# Altium schematic sheet ShieldBoard_Schematic.SchDoc
size A; SheetNumber: 1; SheetTotal: 1
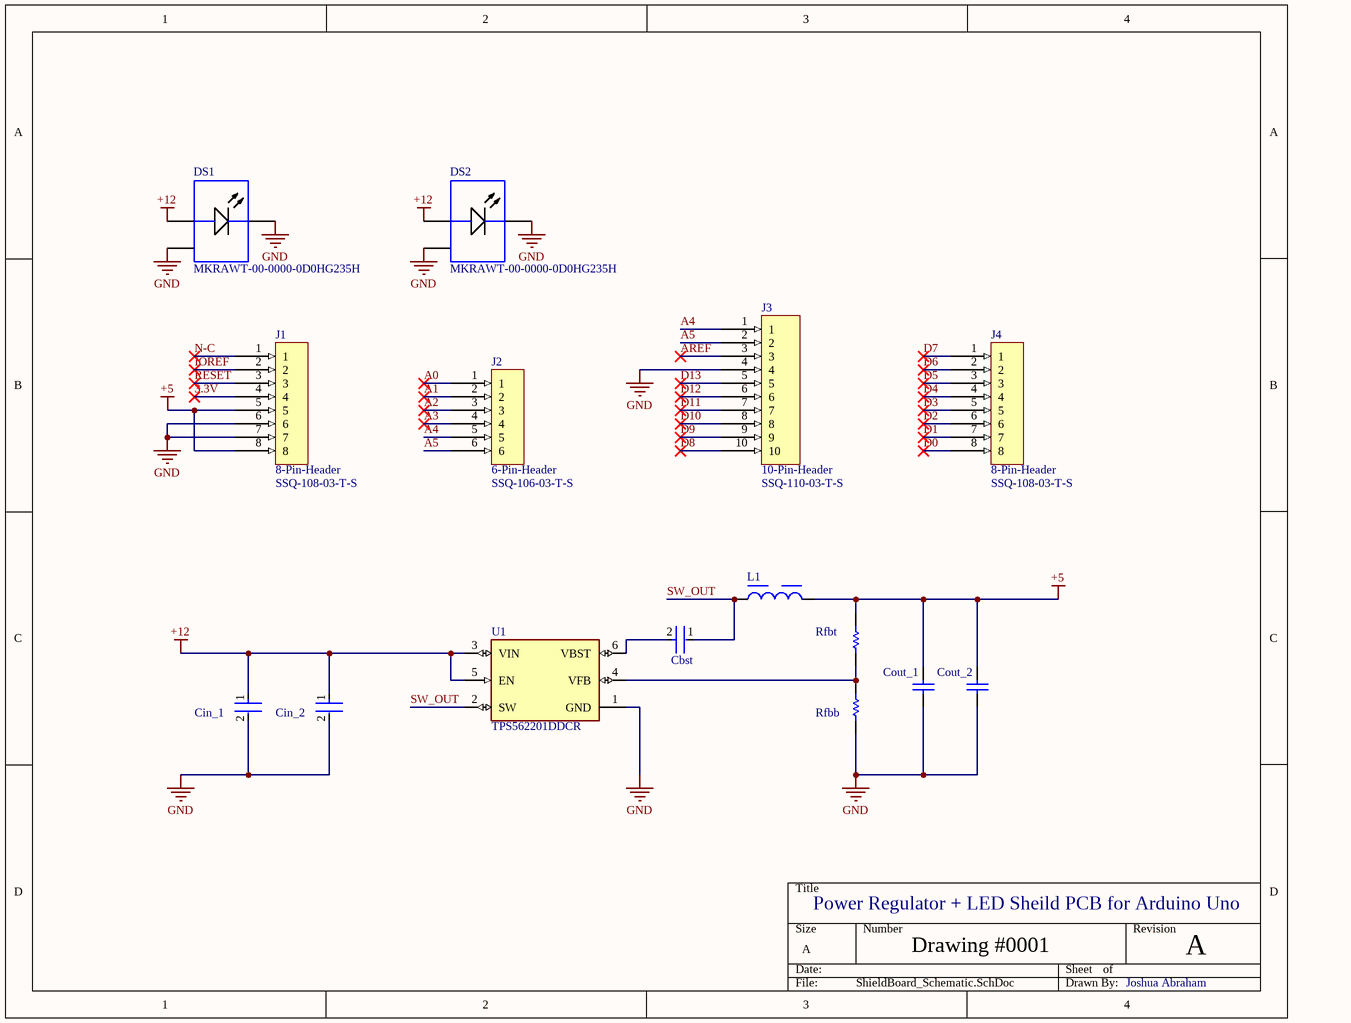
[diagram p0: ShieldBoard_Schematic.SchDoc]

## Parts
Cbst  CC0805KRX7R8BB104  [FP-CC0805-0_85-MFG]  (value not drawn)
Cin_1  GRM21BR6YA106KE43L  [FP-GRM21B-0_2-e0_2_0_7-MFG]  (value not drawn)
Cin_2  GRM21BR6YA106KE43L  [FP-GRM21B-0_2-e0_2_0_7-MFG]  (value not drawn)
Cout_1  C1608X5R1A226M080AC  [CAPC1608X100X20ML10]  (value not drawn)
Cout_2  C1608X5R1A226M080AC  [CAPC1608X100X20ML10]  (value not drawn)
DS1  MKRAWT-00-0000-0D0HG235H  [CREE-MK-R-2_V]
DS2  MKRAWT-00-0000-0D0HG235H  [CREE-MK-R-2_V]
J1  8-Pin-Header  Manufacturer Part Number: SSQ-108-03-T-S  [8-Pin-Header-Footprint-1]
J2  6-Pin-Header  Manufacturer Part Number: SSQ-106-03-T-S  [6-Pin-Header-Footprint-1]
J3  10-Pin-Header  Manufacturer Part Number: SSQ-110-03-T-S  [10-Pin-Header-Footprint-1]
J4  8-Pin-Header  Manufacturer Part Number: SSQ-108-03-T-S  [8-Pin-Header-Footprint-1]
L1  74437324033  [WE-LHMI_4020]  (value not drawn)
Rfbb  ERJ2RKF1002X  [RESC1005X40X25LL05T05]  (value not drawn)
Rfbt  CRCW020156K2FNED  [RESC0603X28X15NL05T05]  (value not drawn)
U1  TPS562201DDCR  [FP-DDC0006A-IPC_C]

## Nets
+5: Cout_1.2 Cout_2.2 J1.5 J1.8 L1.2 Rfbt.2
+12: Cin_1.1 Cin_2.1 DS1.1(A) DS2.1(A) U1.3(VIN) U1.5(EN)
GND: Cin_1.2 Cin_2.2 Cout_1.1 Cout_2.1 DS1.2(K) DS1.3(EP) DS2.2(K) DS2.3(EP) J1.6 J1.7 J3.4 Rfbb.1 U1.1(GND)
3.3V: J1.4
A0: J2.1
A1: J2.2
A2: J2.3
A3: J2.4
A4: J2.5 J3.1
A5: J2.6 J3.2
AREF: J3.3
D0: J4.8
D1: J4.7
D2: J4.6
D3: J4.5
D4: J4.4
D5: J4.3
D6: J4.2
D7: J4.1
D8: J3.10
D9: J3.9
D10: J3.8
D11: J3.7
D12: J3.6
D13: J3.5
IOREF: J1.2
N-C: J1.1
RESET: J1.3
SW_OUT: Cbst.1 L1.1 U1.2(SW)
NetCbst_2: Cbst.2 U1.6(VBST)
NetRfbb_2: Rfbb.2 Rfbt.1 U1.4(VFB)

## Notes on the sheet
- Power Regulator + LED Sheild PCB for Arduino Uno
- Drawing #0001
- A
- Joshua Abraham

## Library data of the parts
Cbst = CMP-1036-04410-2: CAP CER 0.1UF 25V X7R 0805; Manufacturer: Yageo; Tolerance: 0.1; Value: 100 nF; ComponentLink2URL: http://www.yageo.com/documents/recent/UPY-GPHC_Y5V_6.3V-to-50V_8.pdf; Category: Cap; Mouser Description: Multilayer Ceramic Capacitors MLCC - SMD/SMT 100nF 25V X7R 10%; Manufacturer Part Number: CC0805KRX7R8BB104; Device Class L1: Passive Components; Footprint Url: http://www.yageo.com/exep/pages/download/literatures/UPY-C_GEN_24.pdf; Height: 0.95mm; Material: Ceramic; Digikey Description: CAP CER 0.1UF 25V X7R 0805; Lead Free: Yes; Temperature Range High: +85°C; Temperature: -30°C to +85°C; Ipc Land Pattern Name: CAPC200125X85; Capacitance: 100 nF; Automotive: No; Octopart: https://octopart.com/cc0805krx7r8bb104-yageo-39467766; Device Class L2: Capacitors; Temperature Characteristic: X7R; Voltage Rating: 25 V; ComponentLink2Description: Datasheet; Temperature Range Low: -30°C; Device Class L3: Ceramic Capacitors; RoHS: TRUE; Package: CC0805-0.85
Cin_1 Cin_2 = CMP-06035-048920-1: Chip Multilayer Ceramic Capacitors for General Purpose, 0805, 10uF, X5R, 15%, 10%, 35V; Max Operating Temperature: 85°C; REACH SVHC: No SVHC; Packaging: Tape and Reel; Thickness: 0.057inch; Tolerance: 10%; Capacitance: 10uF; Case Code (Imperial): 0805; Height: 1.25mm; Width: 0.049inch; Length: 0.079inch; Lead Free: Lead Free; Voltage Rating: 35V; Case/Package: 0805; Dielectric: X5R; Min Operating Temperature: -55°C; Package Quantity: 3000; Termination: SMD/SMT; Case Code (Metric): 2012; Weight: 0.000335oz; Mount: Surface Mount; Voltage Rating (DC): 35V
Cout_1 Cout_2 = CMP-2000-05441-1: Chip Capacitor, 22 uF, +/- 20%, 10 V, -55 to 85 degC, 0603 (1608 Metric), RoHS, Tape and Reel; Manufacturer: TDK; PCN Part Number: MLCCPartNumberChange30/Nov/2012; Voltage - Rated: 10V; Product Training Modules: CSeriesGeneralApplicationsSEAT,CCV,andTVCLDesignToolsGuidetoReplacinganElectrolyticCapacitorwithanMLCC; Other Names: 445-9077-1; Design Resources: 20WNon-IsolatedBuckLEDDriverUsingPLLNK460KG; Online Catalog: CSeries,GeneralPurpose; Capacitance: 22µF; Temperature Coefficient: X5R; Kits: 445-9014-KIT-ND-KITMLCC100PF-22UF060310-50V; Packaging: CutTape(CT); Standard Package: 1; Package / Case: 0603(1608Metric); Lead Style: -; Features: -; Ratings: -; Operating Temperature: -55degC~85degC; Applications: GeneralPurpose; Package Reference: 603; Datasheet URL: http://download.siliconexpert.com/pdfs/2015/4/21/15/54/45/779/tdk_/manual/37024850441143360mlcc_commercial_general_en.pdf; Datasheet Version: Mar-15; Mounting Type: SurfaceMount,MLCC; Lead Spacing: -; Size / Dimension: 0.063"Lx0.031"W(1.60mmx0.80mm); Height - Seated (Max): -; Package Description: 2-Pin Surface Mount Device, Body 1.6 x 0.8 mm; Manufacturer URL: http://www.tdk.com/; RoHS Information: RoHSCertificate-MLCC; Tolerance: ±20%; Series: C; Thickness (Max): 0.035"(0.90mm); Family: CeramicCapacitors; Category: Capacitors
DS1 DS2 = CMP-2100-00977-1: LED, White, 12 V, 2-Pin SMD, RoHS, Tape and Reel
J1 J4 = CMP-002-00073-2: 1x8 Header for arduino sheild board; Number of Positions: 8; Pitch: 0.1inch; Connector Type: Receptacle; Gender: Female; Housing Color: Black; Number of Rows: 1; Contact Plating: Tin; Radiation Hardening: No; Height: 8.51mm; Series: SSQ; Termination: Solder; RoHS Compliant: Yes; Lead Free: Lead Free; Contact Type: Female Socket; Length: 20.8mm; Contact Material: Bronze; Color: Black; Number of Contacts: 8; Width: 2.41mm; Packaging: Bulk; Mounting Technology: Through Hole; Housing Material: Plastic
J2 = CMP-001-00083-1: 1x6 Header for arduino shield board
J3 = CMP-002-00074-1: 1x10 Header for arduino sheild board; Gender: Female; Connector Type: Receptacle; Number of Contacts: 10; Pitch: 0.1inch; Housing Color: Black; Housing Material: Plastic; Radiation Hardening: No; Mounting Technology: Through Hole; Package Quantity: 1; Length: 25.9mm; Contact Type: Female Socket; Lead Free: Lead Free; Number of Rows: 1; Contact Material: Bronze; RoHS Compliant: Yes; Color: Black; Packaging: Bulk; Series: SSQ; Termination: Solder; Width: 2.41mm; Height: 8.51mm; Contact Plating: Tin; Number of Positions: 10
L1 = CMP-1353-00028-3: NexarPartId: 21272405; Core Material: Composite, Ferrite; Inductance: 3.3µH; Tolerance: 20%; Saturation Current: 2.75A; DC Resistance (DCR): 69mΩ; Current Rating: 2.5A; Series Resistance: 76mΩ; Shielding: Shielded; Test Frequency: 100kHz; Frequency: 40MHz; Ambient Temperature Range Low: -40°C; Width: 4.06mm; Lead Free: Lead Free; Mount: Surface Mount; Length: 4.45mm; Height - Seated (Max): 2.0066mm; Height: 1.8mm; RoHS: Compliant; REACH SVHC: Unknown; Min Operating Temperature: -40°C; Case/Package: Nonstandard; Termination: SMD/SMT; Max DC Current: 2.5A; RMS Current (Irms): 2.5A; Depth: 4.06mm; Packaging: Tape & Reel (TR); Inductance Tolerance: 20%; Ambient Temperature Range High: 85°C; Max Operating Temperature: 125°C; Number of Pins: 2; Self Resonant Frequency: 40MHz; Composition: Wirewound
Rfbb = CMP-2000-07588-1: Chip Resistor, 10 KOhm, +/- 1%, 0.1 W, -55 to 155 degC, 0402 (1005 Metric), RoHS, Tape and Reel; Manufacturer: Panasonic; Power Rating: 100mW; Voltage Rating: 50V; Resistance: 10KOhm; Case\/Package: 0402; Temperature Coefficient: 100ppm\/degreesC; RoHSCompliant: True; Lead Free: LeadFree; Package Quantity: 1; Contact Plating: Tin; Length: 1mm; Radiation Hardening: No; REACH SVHC: NoSVHC; Max Operating Temperature: 155degC; Depth: 0.5mm; Case Code (Imperial): 0402; Military Standard: Not; Package Description: 2-Pin Surface Mount Device, Body 1 x 0.5 mm; Termination: SMD/SMT; Case Code (Metric): 1005; Height: 0.35mm; Packaging: TapeandReel; Voltage Rating (DC): 50V; Package Reference: 402; Number of Pins: 2; Tolerance: 1%; Mounting Technology: SurfaceMount; Width: 0.02inch; Mount: SurfaceMount; Datasheet URL: https://industrial.panasonic.com/cdbs/www-data/pdf/RDA0000/AOA0000C304.pdf; Composition: ThickFilm; Datasheet Version: 02/2017; Manufacturer URL: http://www.panasonic.com/; Max Power Dissipation: 100mW; Number of Terminations: 2; Min Operating Temperature: -55degC
Rfbt = CMP-2004-00723-1: Manufacturer: Vishay Dale; Part Number: CRCW020156K2FNED
U1 = CMP-04918-000361-1: IC REG BUCK ADJ 2A TSOT23-6; Switching Frequency: 580kHz; Max Input Voltage: 17V; Number of Outputs: 1; Output Voltage: 7V; Output Type: Adjustable; Quiescent Current: 400uA; Min Input Voltage: 4.5V; Mount: Surface Mount; Max Operating Temperature: 125°C; Lead Free: Lead Free; Operating Supply Voltage: 17V; Number of Pins: 6; RoHS Compliant: Yes; Contact Plating: Tin; Min Operating Temperature: -40°C; Case/Package: SOT; Max Output Current: 2A